# Altium schematic sheet PCB_Slave_Traffic_Light_BLOCK_DIAGRAM.SchDoc (part 1 of 4)
size A3; SheetNumber: 2; SheetTotal: 3
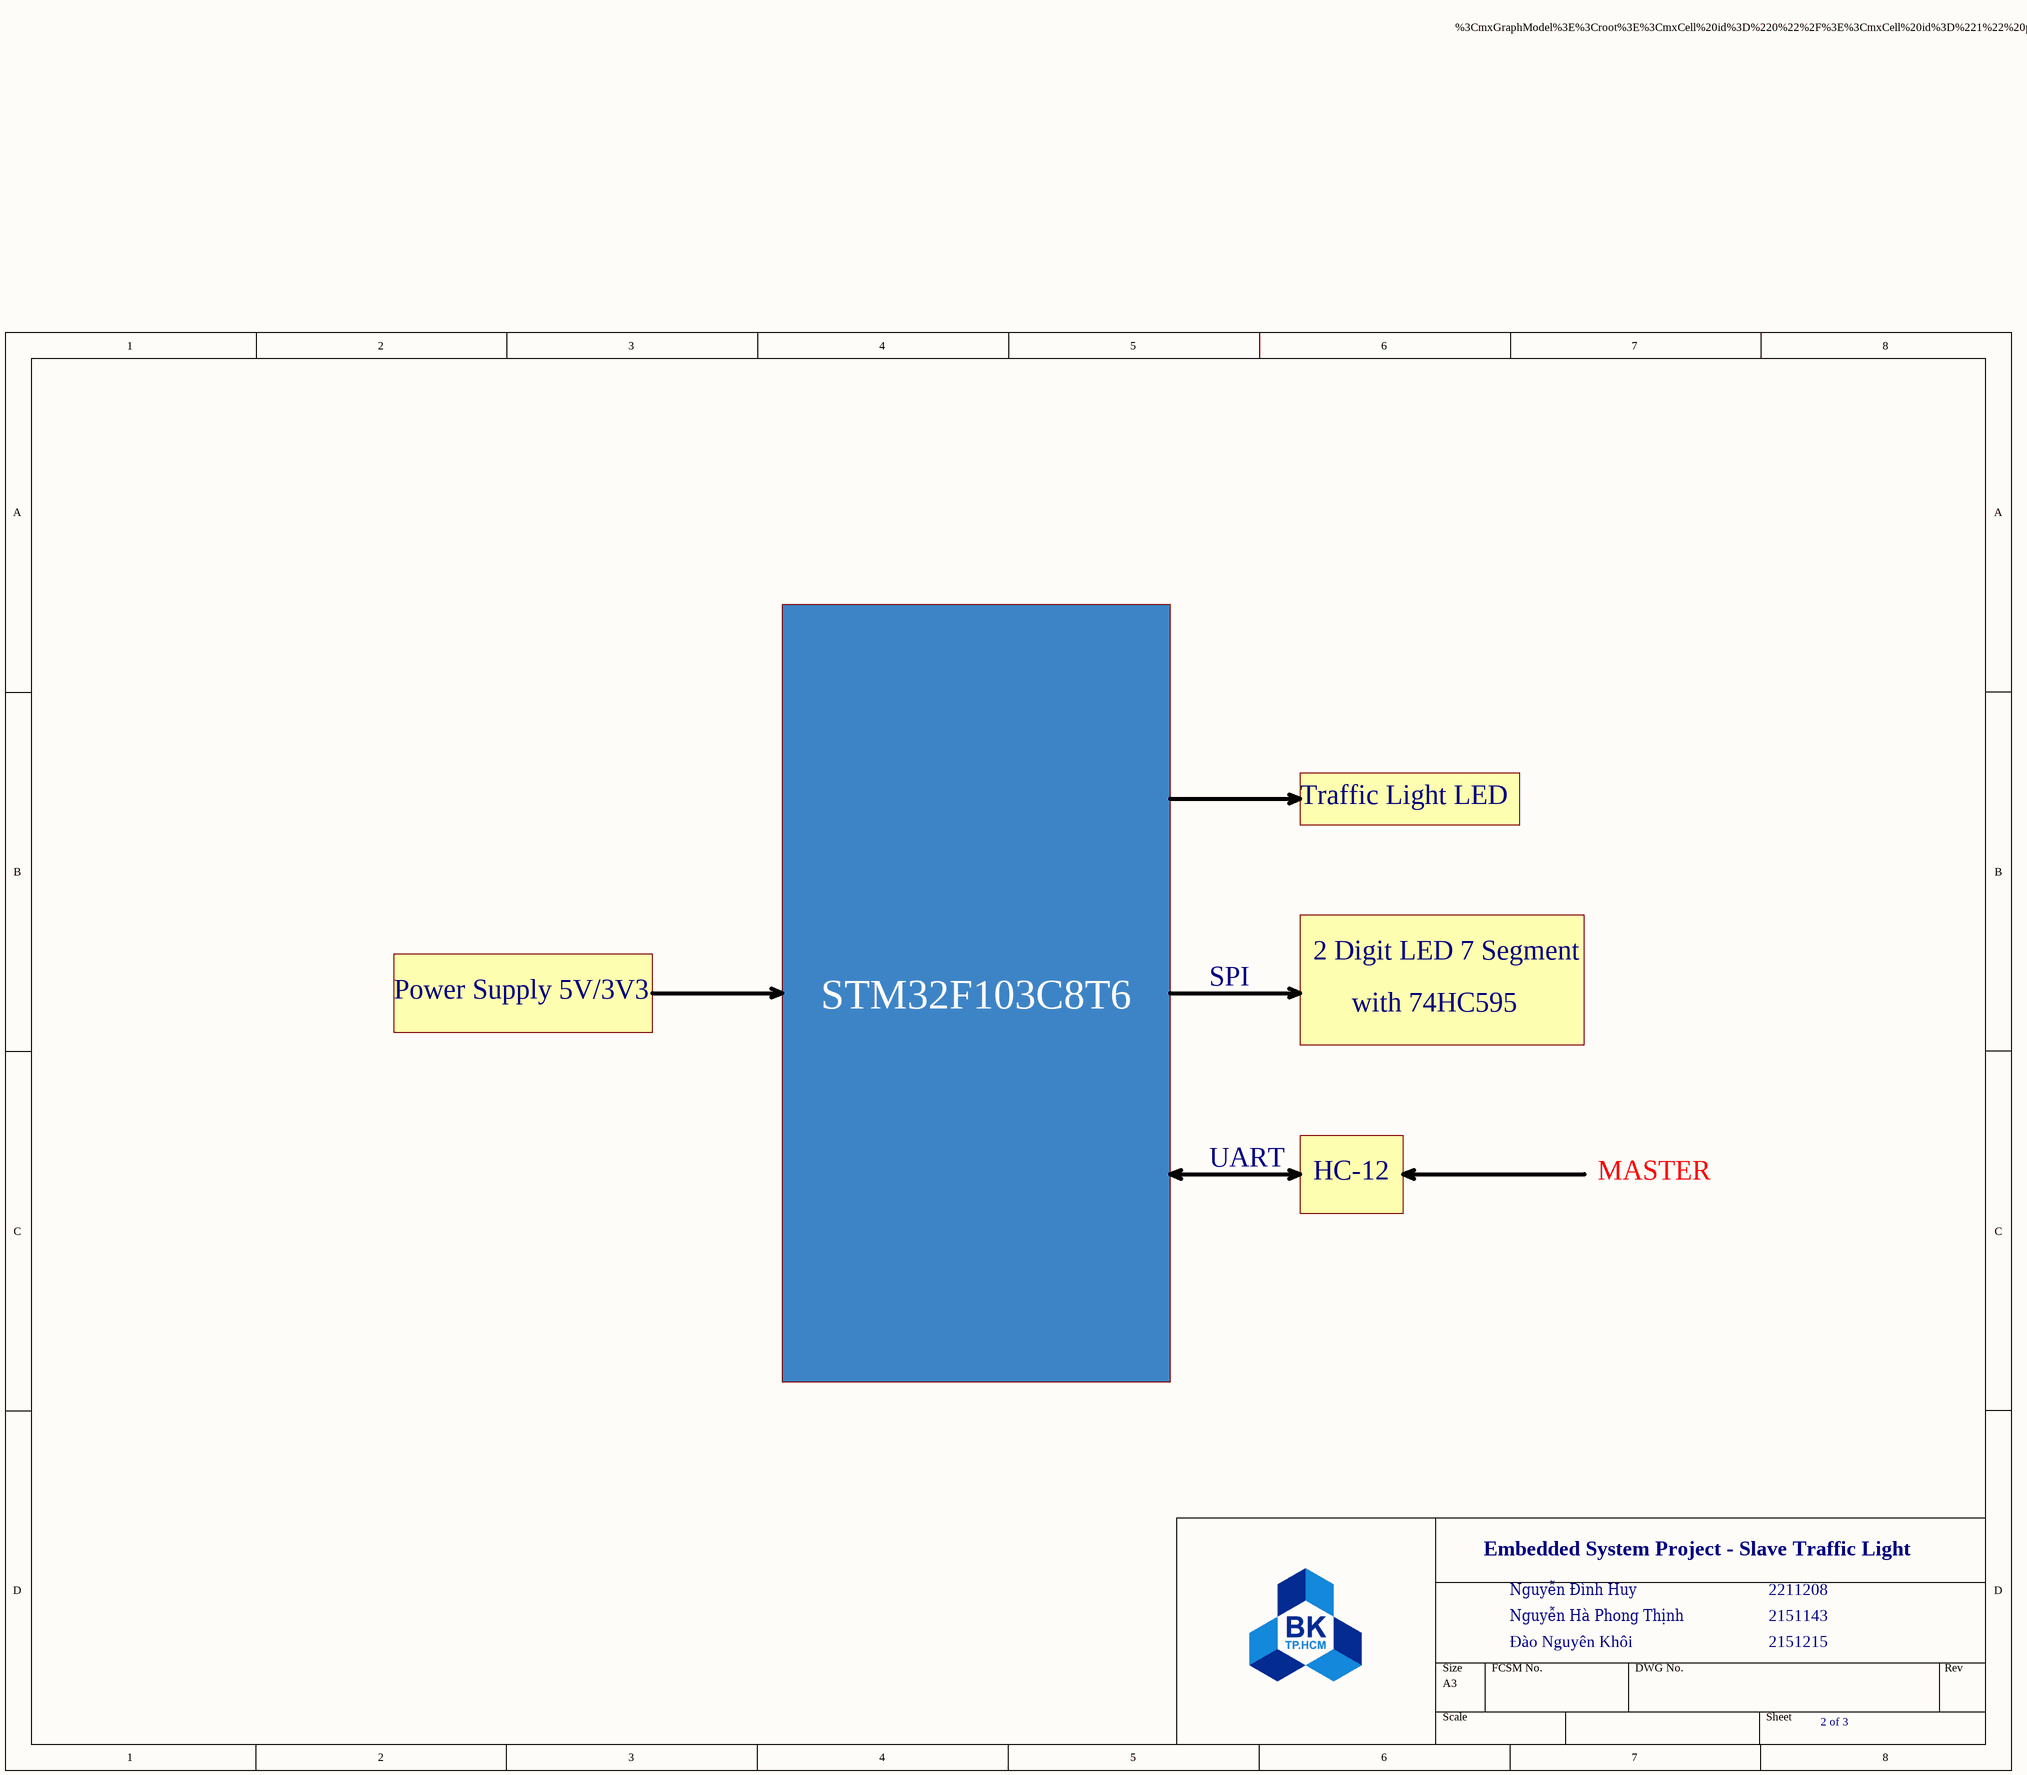
[diagram p0: PCB_Slave_Traffic_Light_BLOCK_DIAGRAM.SchDoc]
## Notes on the sheet